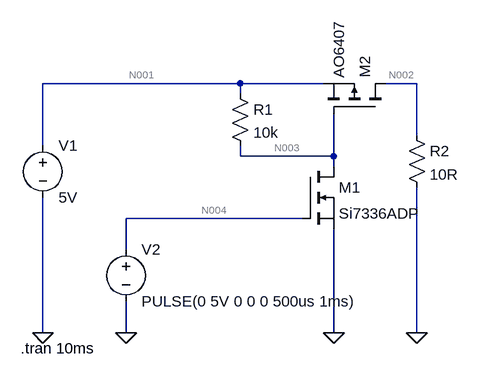
[diagram p0: schematic comutador-para-fonte.asc]
comutador-para-fonte.asc, the LTspice schematic file:
Version 4
SHEET 1 880 680
WIRE 304 -32 0 -32
WIRE 432 -32 304 -32
WIRE 576 -32 528 -32
WIRE 304 -16 304 -32
WIRE 576 48 576 -32
WIRE 0 64 0 -32
WIRE 304 80 304 64
WIRE 448 80 448 16
WIRE 448 80 304 80
WIRE 448 96 448 80
WIRE 400 176 128 176
WIRE 128 224 128 176
WIRE 0 352 0 144
WIRE 128 352 128 304
WIRE 448 352 448 192
WIRE 576 352 576 128
FLAG 0 352 0
FLAG 128 352 0
FLAG 448 352 0
FLAG 576 352 0
SYMBOL voltage 0 48 R0
WINDOW 123 0 0 Left 0
WINDOW 39 0 0 Left 0
SYMATTR InstName V1
SYMATTR Value 5V
SYMBOL voltage 128 208 R0
WINDOW 123 0 0 Left 0
WINDOW 39 0 0 Left 0
SYMATTR InstName V2
SYMATTR Value PULSE(0 5V 0 0 0 500us 1ms)
SYMBOL res 288 -32 R0
SYMATTR InstName R1
SYMATTR Value 10k
SYMBOL res 560 32 R0
SYMATTR InstName R2
SYMATTR Value 10R
SYMBOL nmos 400 96 R0
SYMATTR InstName M1
SYMATTR Value Si7336ADP
SYMBOL pmos 528 16 M270
SYMATTR InstName M2
SYMATTR Value AO6407
TEXT -34 376 Left 2 !.tran 10ms

The netlist it stands for:
* comutador-para-fonte.asc
V1 N001 0 5V
V2 N004 0 PULSE(0 5V 0 0 0 500us 1ms)
R1 N001 N003 10k
R2 N002 0 10R
M1 N003 N004 0 0 Si7336ADP
M2 N002 N003 N001 N001 AO6407
.model NMOS NMOS
.model PMOS PMOS
.lib standard.mos
.tran 10ms
.backanno
.end

* Results of the author's LTspice run, read from the files saved beside the schematic
* Operating Point, zero values left out:
*   V(n001) = 5 V
*   V(n003) = 5 V
*   V(n002) = 180.4 nV
*   Id(M2) = -18.03 nA
*   Is(M2) = 18.03 nA
*   Id(M1) = 10.07 pA
*   Is(M1) = -10.07 pA
*   I(R2) = 18.04 nA
*   I(R1) = 15.3 pA
*   I(V1) = -18.05 nA
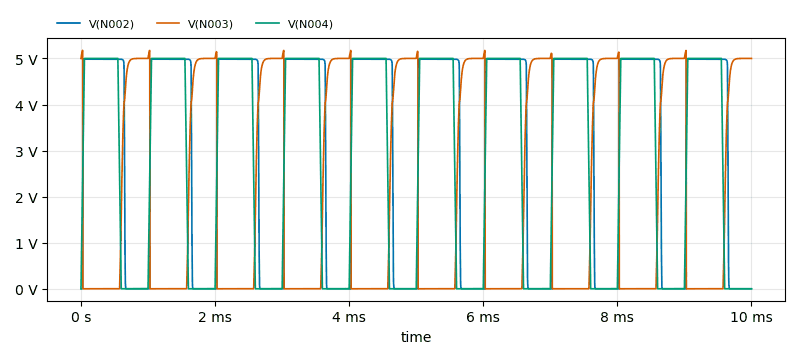
[diagram p1: Transient Analysis of comutador-para-fonte.asc, plotted from the saved traces]
* Transient Analysis, 1 run:
*   V(N002): min -684.4 µV, max 4.984 V, average 3.112 V, rms 3.928 V, last 0 V
*   V(N003): min 637.6 nV, max 5.175 V, average 2.037 V, rms 3.121 V, last 5 V
*   V(N004): min 0 V, max 5 V, average 2.75 V, rms 3.653 V, last 0 V